# Altium schematic sheet COM.SchDoc
size A3; SheetNumber: 5; SheetTotal: 5
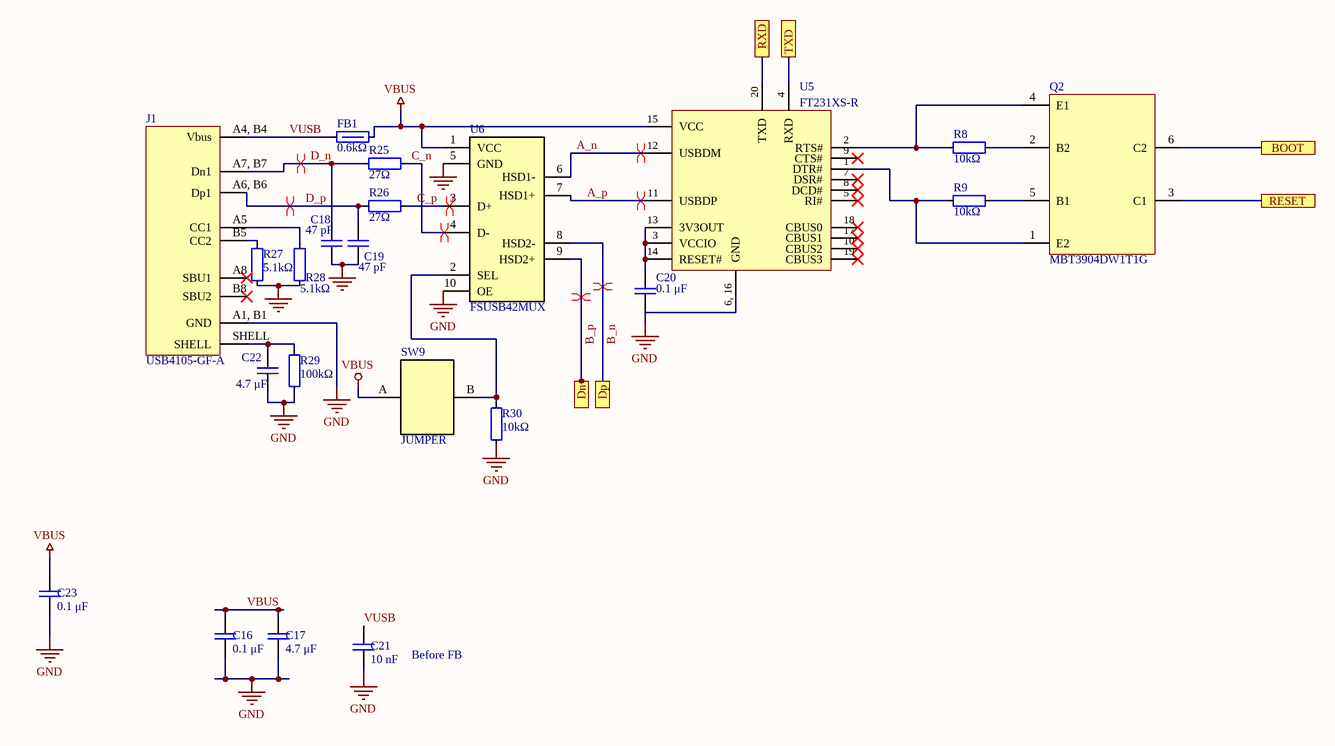
[diagram p0: COM.SchDoc]

## Parts
C16  0.1 μF  [Capacitor 0603]
C17  4.7 μF  [Capacitor 0603]
C18  47 pF  [Capacitor 0603]
C19  47 pF  [Capacitor 0603]
C20  0.1 μF  [Capacitor 0603]
C21  10 nF  [Capacitor 0603]
C22  4.7 μF  [Capacitor 0603]
C23  0.1 μF  [Capacitor 0603]
FB1  0.6kΩ  [Ferrite Bead 0603]
J1  USB4105-GF-A  [USB4105-GF-A]
Q2  MBT3904DW1T1G  [2NPN transistor]
R8  10kΩ  [Resistor 0603]
R9  10kΩ  [Resistor 0603]
R25  27Ω  [Resistor 0603]
R26  27Ω  [Resistor 0603]
R27  5.1kΩ  [Resistor 0603]
R28  5.1kΩ  [Resistor 0603]
R29  100kΩ  [Resistor 0603]
R30  10kΩ  [Resistor 0603]
SW9  JUMPER  [Jumper]
U5  FT231XS-R  [FT231XS-R]
U6  FSUSB42MUX  [FSUSB42MUX]

## Ports
BOOT (see Main[3B], MCU[4C]), Dn (see Main[3B], MCU[5B]), Dp (see Main[3B], MCU[5B]), RESET (see Main[3A], MCU[4B]), RXD (see Main[3B], MCU[4B]), TXD (see Main[3B], MCU[4B])

## Nets
GND: C16.A C17.A C18.A C19.A C20.A C21.A C22.A C23.A J1.A1,_B1(GND) R27.A R28.A R29.A R30.B U5.6,_16(GND) U6.5(GND) U6.10(OE)
VBUS: C16.B C17.B C23.B FB1.B SW9.A U5.15(VCC) U6.1(VCC)
A_n: U5.12(USBDM) U6.6(HSD1-)
A_p: U5.11(USBDP) U6.7(HSD1+)
B_n: U6.8(HSD2-) ; port Dp
B_p: U6.9(HSD2+) ; port Dn
BOOT: Q2.6(C2) ; port BOOT
C_n: R25.B U6.4(D-)
C_p: R26.B U6.3(D+)
D_n: C18.B J1.A7,_B7(Dn1) R25.A
D_p: C19.B J1.A6,_B6(Dp1) R26.A
RESET: Q2.3(C1) ; port RESET
RXD: U5.20(TXD) ; port RXD
TXD: U5.4(RXD) ; port TXD
VUSB: C21.B FB1.A J1.A4,_B4(Vbus)
NetC20_B: C20.B U5.3(VCCIO) U5.13(3V3OUT) U5.14(RESET#)
NetC22_B: C22.B J1.SHELL R29.B
NetJ1_A5: J1.A5(CC1) R28.B
NetJ1_B5: J1.B5(CC2) R27.B
NetQ2_1: Q2.1(E2) R9.A U5.1(DTR#)
NetQ2_2: Q2.2(B2) R8.B
NetQ2_4: Q2.4(E1) R8.A U5.2(RTS#)
NetQ2_5: Q2.5(B1) R9.B
NetR30_A: R30.A SW9.B U6.2(SEL)

Not connected (* = marked no-connect by the designer): J1 A8(SBU1)* B8(SBU2)*; U5 5(RI#)* 7(DSR#)* 8(DCD#)* 9(CTS#)* 10(CBUS2)* 17(CBUS1)* 18(CBUS0)* 19(CBUS3)*

## Layout directives
differential pair: A_n, A_p, B_n, B_p, C_n, C_p, D_n, D_p

## Notes on the sheet
- (near C21) Before FB

## Library data of the parts
C16 C20 C23 = 0.1 μF 0603: Capacitor 0.1 μF; Manufacturer: Samsung Electro-Mechanics; Manufacturer Part Number: CL10B104KB8NNWC; Supplier 1: Digikey; Supplier Part Number 1: 1276-1935-1-ND; Value: 0.1 μF
C17 C22 = 4,7 μF 0603: Capacitor 4.7 μF; Manufacturer: Samsung Electro-Mechanics; Manufacturer Part Number: CL10A475KP8NNNC; Supplier 1: Digikey; Supplier Part Number 1: 1276-1044-1-ND; Value: 4.7 μF
C18 C19 = 47 pF 0603: Capacitor 47 pF; Manufacturer: Walsin Technology Corporation; Manufacturer Part Number: 0603N470J500CT; Supplier 1: Digikey; Supplier Part Number 1: 1292-1528-1-ND; Value: 47 pF
C21 = 10 nF 0603: Capacitor 10 nF; Manufacturer: Samsung Electro-Mechanics; Manufacturer Part Number: CL10B103KB8NNNC; Supplier 1: Digikey; Supplier Part Number 1: 1276-1009-1-ND; Value: 10 nF
FB1 = FB 0.6 kΩ 0603: Ferrite Bead 600 Ω; Manufacturer: Murata Electronics; Manufacturer Part Number: BLM18AG601SN1D; Supplier 1: Digikey; Supplier Part Number 1: 490-1014-1-ND; Value: 0.6kΩ
J1 = USB4105-GF-A: CONN RCPT TYPE C 6P SMD RA; Manufacturer: GCT; Supplier 1: Digikey; Supplier Part Number 1: 2073-USB4105-GF-ACT-ND; Manufacturer Part Number: USB4105-GF-A
Q2 = MBT3904DW1T1G: TRANS 2NPN 40V 0.2A SC88/SC70-6; Manufacturer: onsemi; Supplier 1: Digikey; Supplier Part Number 1: MBT3904DW1T1GOSCT-ND; Manufacturer Part Number: MBT3904DW1T1G
R8 R9 R30 = 10 kΩ 0603: Resistor 10000 Ω; Manufacturer: Stackpole Electronics Inc; Manufacturer Part Number: RMCF0603FT10K0; Supplier 1: Digikey; Supplier Part Number 1: RMCF0603FT10K0CT-ND; Value: 10kΩ
R25 R26 = 27 Ω 0603: Resistor 27 Ω; Manufacturer: Stackpole Electronics Inc; Manufacturer Part Number: RMCF0603FT27R0; Supplier 1: Digikey; Supplier Part Number 1: RMCF0603FT27R0CT-ND; Value: 27Ω
R27 R28 = 5.1 kΩ 0603: Resistor 5100 Ω; Manufacturer: Stackpole Electronics IncStackpole Electronics Inc; Manufacturer Part Number: RMCF0603FT5K10; Supplier 1: Digikey; Supplier Part Number 1: RMCF0603FT5K10CT-ND; Value: 5.1kΩ
R29 = 100 kΩ 0603: Resistor 100000 Ω; Manufacturer: Stackpole Electronics Inc; Manufacturer Part Number: RMCF0603FT100K; Supplier 1: Digikey; Supplier Part Number 1: RMCF0603FT100KCT-ND; Value: 100kΩ
U5 = FT231XS-R_1: IC USB SERIAL FULL UART 20SSOP; Manufacturer: FTDI, Future Technology Devices International Ltd; Supplier 1: Digikey; Supplier Part Number 1: 768-1129-1-ND; Manufacturer Part Number: FT231XS-R
U6 = FSUSB42MUX: IC USB SWITCH DPDT 10MSOP; Manufacturer: onsemi; Supplier 1: Digikey; Supplier Part Number 1: FSUSB42MUXCT-ND; Manufacturer Part Number: FSUSB42MUX